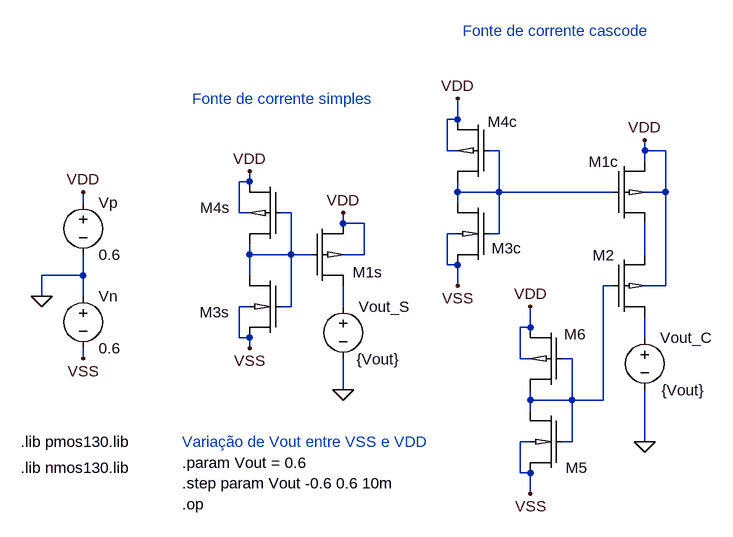
[diagram p0: schematic ComparacaoFonte_Simples_Cascode.asc]
ComparacaoFonte_Simples_Cascode.asc, the LTspice schematic file:
Version 4.1
SHEET 1 968 680
WIRE 128 -480 128 -512
WIRE 128 -480 112 -480
WIRE 112 -432 112 -480
WIRE 128 -432 112 -432
WIRE 192 -432 176 -432
WIRE 416 -432 416 -448
WIRE 448 -432 416 -432
WIRE 416 -416 416 -432
WIRE -192 -384 -192 -400
WIRE -192 -384 -208 -384
WIRE 128 -368 128 -384
WIRE 192 -368 192 -432
WIRE 192 -368 128 -368
WIRE 368 -368 192 -368
WIRE 448 -368 448 -432
WIRE 448 -368 416 -368
WIRE -448 -352 -448 -368
WIRE 128 -352 128 -368
WIRE -208 -336 -208 -384
WIRE -192 -336 -208 -336
WIRE -128 -336 -144 -336
WIRE -48 -320 -48 -336
WIRE -16 -320 -48 -320
WIRE 128 -304 112 -304
WIRE 192 -304 192 -368
WIRE 192 -304 176 -304
WIRE -192 -272 -192 -288
WIRE -128 -272 -128 -336
WIRE -128 -272 -192 -272
WIRE -96 -272 -128 -272
WIRE -16 -272 -16 -320
WIRE -16 -272 -48 -272
WIRE 416 -272 416 -320
WIRE 112 -256 112 -304
WIRE 128 -256 112 -256
WIRE -448 -240 -448 -272
WIRE -448 -240 -512 -240
WIRE -192 -240 -192 -272
WIRE 128 -224 128 -256
WIRE 368 -224 352 -224
WIRE 448 -224 448 -368
WIRE 448 -224 416 -224
WIRE -512 -208 -512 -240
WIRE -448 -208 -448 -240
WIRE -192 -192 -208 -192
WIRE -128 -192 -128 -272
WIRE -128 -192 -144 -192
WIRE -48 -192 -48 -224
WIRE 240 -160 240 -192
WIRE 240 -160 224 -160
WIRE -208 -144 -208 -192
WIRE -192 -144 -208 -144
WIRE 416 -144 416 -176
WIRE -192 -128 -192 -144
WIRE -448 -112 -448 -128
WIRE 224 -112 224 -160
WIRE 240 -112 224 -112
WIRE 304 -112 288 -112
WIRE -48 -64 -48 -112
WIRE 240 -48 240 -64
WIRE 304 -48 304 -112
WIRE 304 -48 240 -48
WIRE 352 -48 352 -224
WIRE 352 -48 304 -48
WIRE 240 -32 240 -48
WIRE 240 16 224 16
WIRE 304 16 304 -48
WIRE 304 16 288 16
WIRE 416 16 416 -64
WIRE 224 64 224 16
WIRE 240 64 224 64
WIRE 240 96 240 64
FLAG -512 -208 0
FLAG -448 -112 VSS
FLAG -448 -368 VDD
FLAG 240 -192 VDD
FLAG 128 -512 VDD
FLAG 416 -448 VDD
FLAG 240 96 VSS
FLAG 128 -224 VSS
FLAG 416 16 0
FLAG -48 -336 VDD
FLAG -48 -64 0
FLAG -192 -128 VSS
FLAG -192 -400 VDD
SYMBOL voltage -448 -368 R0
WINDOW 123 0 0 Left 0
WINDOW 39 0 0 Left 0
SYMATTR InstName Vp
SYMATTR Value 0.6
SYMBOL voltage -448 -224 R0
WINDOW 123 0 0 Left 0
WINDOW 39 0 0 Left 0
SYMATTR InstName Vn
SYMATTR Value 0.6
SYMBOL pmos130 368 -416 R0
WINDOW 0 -38 1 Left 2
WINDOW 3 56 72 Invisible 2
SYMATTR InstName M1c
SYMATTR SpiceLine width=6463n length=400n
SYMBOL pmos130 368 -272 R0
WINDOW 0 -32 1 Left 2
WINDOW 3 56 72 Invisible 2
SYMATTR InstName M2
SYMATTR SpiceLine width=13460n length=400n
SYMBOL nmos130 176 -352 M0
WINDOW 0 -50 70 Left 2
WINDOW 3 56 72 Invisible 2
SYMATTR InstName M3c
SYMATTR SpiceLine width=600n length=10480n
SYMBOL nmos130 288 -32 M0
WINDOW 0 -40 88 Left 2
WINDOW 3 56 72 Invisible 2
SYMATTR InstName M5
SYMATTR SpiceLine width=600n length=4929n
SYMBOL pmos130 288 -64 R180
WINDOW 0 -38 85 Left 2
WINDOW 3 56 72 Invisible 2
SYMATTR InstName M6
SYMATTR SpiceLine width=600n length=368n
SYMBOL pmos130 176 -384 R180
WINDOW 0 -44 92 Left 2
WINDOW 3 56 72 Invisible 2
SYMATTR InstName M4c
SYMATTR SpiceLine width=1326n length=300n
SYMBOL voltage 416 -160 R0
WINDOW 3 26 97 Left 2
SYMATTR Value {Vout}
SYMATTR InstName Vout_C
SYMBOL pmos130 -96 -320 R0
WINDOW 0 63 75 Left 2
WINDOW 3 56 72 Invisible 2
SYMATTR InstName M1s
SYMATTR SpiceLine width=3462n length=300n
SYMBOL voltage -48 -208 R0
WINDOW 3 21 97 Left 2
SYMATTR Value {Vout}
SYMATTR InstName Vout_S
SYMBOL pmos130 -144 -288 R180
WINDOW 0 78 56 Left 2
WINDOW 3 56 72 Invisible 2
SYMATTR InstName M4s
SYMATTR SpiceLine width=945n length=403n
SYMBOL nmos130 -144 -240 M0
WINDOW 0 79 57 Left 2
WINDOW 3 56 72 Invisible 2
SYMATTR InstName M3s
SYMATTR SpiceLine width=600n length=8376n
TEXT -544 16 Left 2 !.lib pmos130.lib
TEXT -296 16 Left 2 ;Variação de Vout entre VSS e VDD
TEXT -544 56 Left 2 !.lib nmos130.lib
TEXT -296 48 Left 2 !.param Vout = 0.6
TEXT -296 80 Left 2 !.step param Vout -0.6 0.6 10m
TEXT -296 112 Left 2 !.op
TEXT -280 -512 Left 2 ;Fonte de corrente simples
TEXT 136 -616 Left 2 ;Fonte de corrente cascode

The netlist it stands for:
* ComparacaoFonte_Simples_Cascode.asc
Vp VDD 0 0.6
Vn 0 VSS 0.6
X§M1c VDD N001 N003 VDD pmos130 width=6463n length=400n  ; pins D G S B
X§M2 N003 N004 N006 VDD pmos130 width=13460n length=400n  ; pins D G S B
X§M3c N001 N001 VSS VSS nmos130 width=600n length=10480n  ; pins D G S B
X§M5 N004 N004 VSS VSS nmos130 width=600n length=4929n  ; pins D G S B
X§M6 N004 N004 VDD VDD pmos130 width=600n length=368n  ; pins D G S B
X§M4c N001 N001 VDD VDD pmos130 width=1326n length=300n  ; pins D G S B
Vout_C N006 0 {Vout}
X§M1s VDD N002 N005 VDD pmos130 width=3462n length=300n  ; pins D G S B
Vout_S N005 0 {Vout}
X§M4s N002 N002 VDD VDD pmos130 width=945n length=403n  ; pins D G S B
X§M3s N002 N002 VSS VSS nmos130 width=600n length=8376n  ; pins D G S B
.lib pmos130.lib
* Variação de Vout entre VSS e VDD
.lib nmos130.lib
.param Vout = 0.6
.step param Vout -0.6 0.6 10m
.op
* Fonte de corrente simples
* Fonte de corrente cascode
.backanno
.end